# Altium schematic sheet Altium_1_v03_01_GLUE_LOGIC_4Plane_P1.schdoc
size 309 x 223 mm; Symbol: Sheet-Symbol_A4; Device: Sheet-Symbol_A4; @Project Name: The20c_v03; @Page Count: 3; @Update Date: 2026-09-12; @Create Date: 2024-08-20; @Schematic Name: v03_01_GLUE_LOGIC_4Plane; @Page No: 1; @Page Name: v03_01_GLUE_LOGIC_4Plane_P1; Company: OsoLabs.tech; Reviewed: OsoLabs; Version: v03_01; Page Size: A4; Part Number: v03_01_GLUE_LOGIC; Drawn: OsoLabs; @Board Name: v03_01_GLUE_LOGIC_4Plane; @Create Time: 17:17:24; @Update Time: 11:45:47
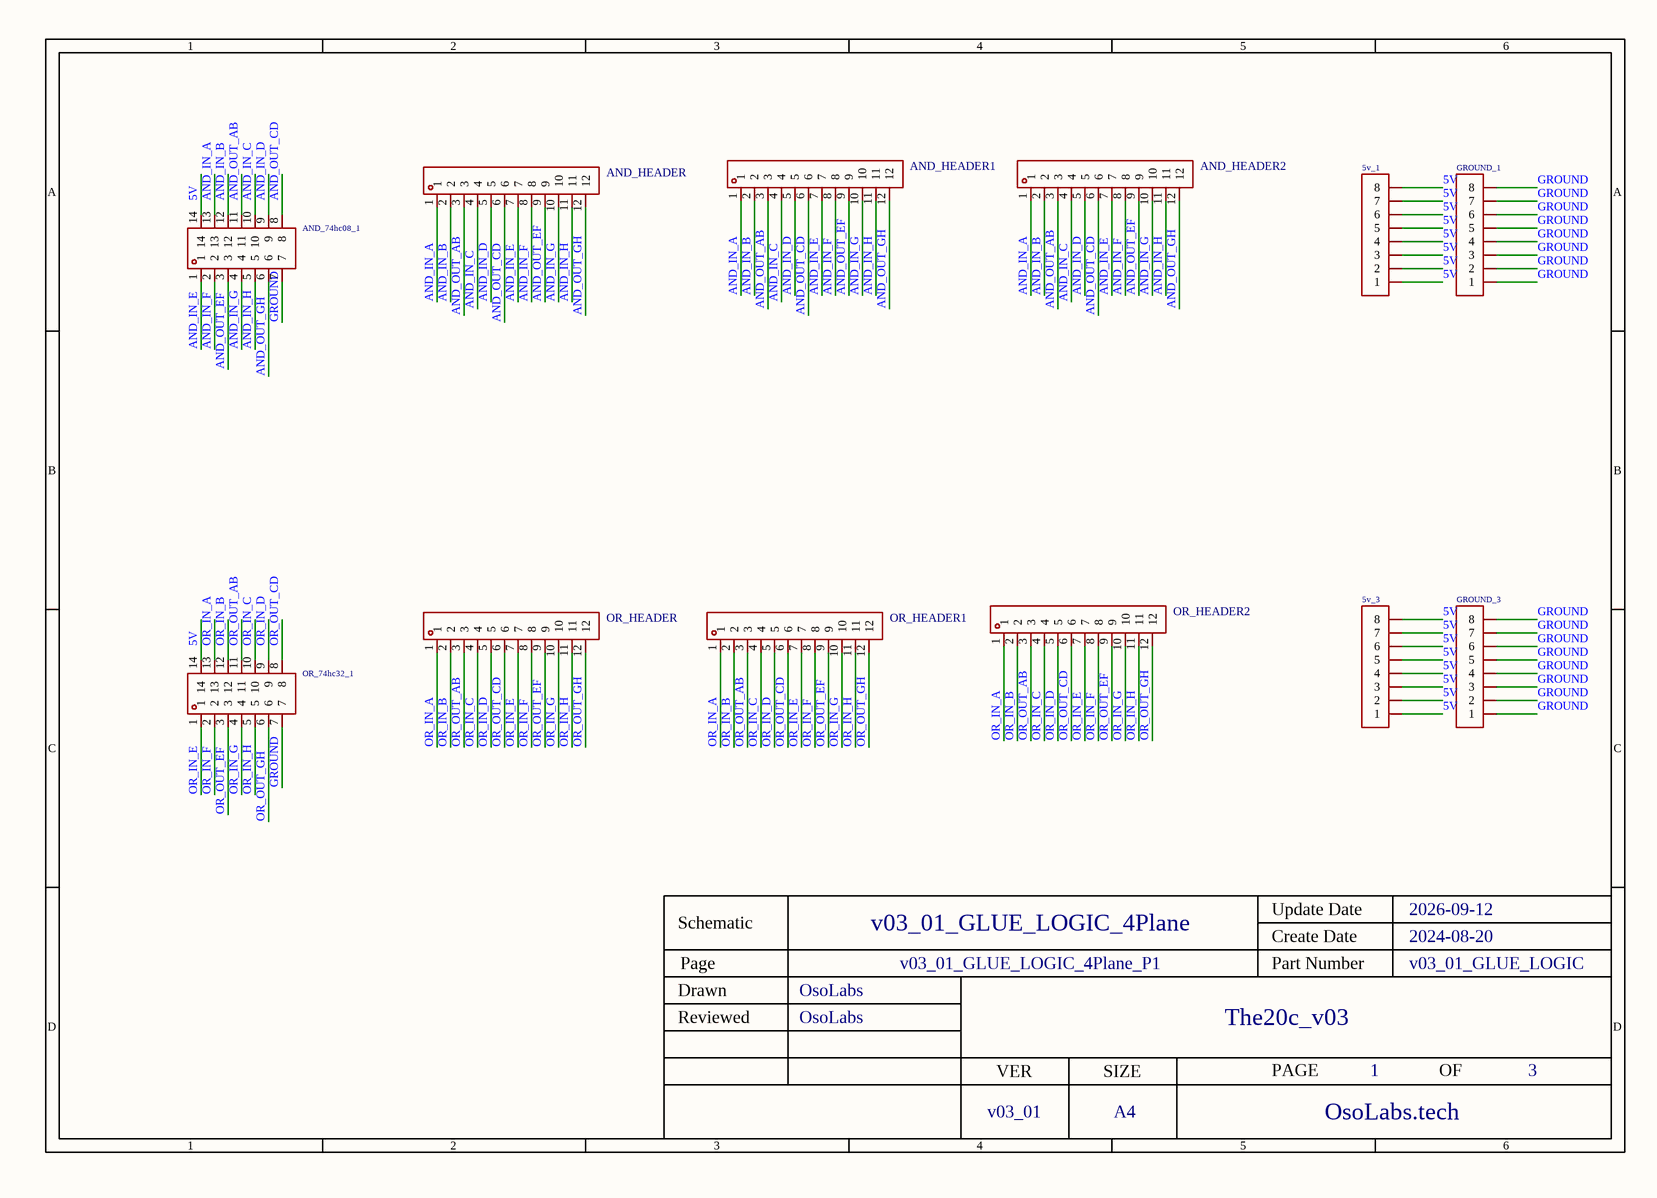
[diagram p0: Altium_1_v03_01_GLUE_LOGIC_4Plane_P1.schdoc]

## Parts
5v_1  2.54-1*8P母环保  [HDR-TH_8P-P2.54-V-F-1]  (value not drawn)
5v_3  2.54-1*8P母环保  [HDR-TH_8P-P2.54-V-F-1]  (value not drawn)
AND_74hc08_1  IC-14P窄  [DIP-14_L17.8-W10.2-P2.54-BL]  (value not drawn)
AND_HEADER  PM254-1-12-Z-8.5  [HDR-TH_12P-P2.54-V-F]  (value not drawn)
AND_HEADER1  PM254-1-12-Z-8.5  [HDR-TH_12P-P2.54-V-F]  (value not drawn)
AND_HEADER2  PM254-1-12-Z-8.5  [HDR-TH_12P-P2.54-V-F]  (value not drawn)
GROUND_1  2.54-1*8P母环保  [HDR-TH_8P-P2.54-V-F-1]  (value not drawn)
GROUND_3  2.54-1*8P母环保  [HDR-TH_8P-P2.54-V-F-1]  (value not drawn)
OR_74hc32_1  IC-14P窄  [DIP-14_L17.8-W10.2-P2.54-BL]  (value not drawn)
OR_HEADER  PM254-1-12-Z-8.5  [HDR-TH_12P-P2.54-V-F]  (value not drawn)
OR_HEADER1  PM254-1-12-Z-8.5  [HDR-TH_12P-P2.54-V-F]  (value not drawn)
OR_HEADER2  PM254-1-12-Z-8.5  [HDR-TH_12P-P2.54-V-F]  (value not drawn)

## Nets
5V: 5v_1.1 5v_1.2 5v_1.3 5v_1.4 5v_1.5 5v_1.6 5v_1.7 5v_1.8 5v_3.1 5v_3.2 5v_3.3 5v_3.4 5v_3.5 5v_3.6 5v_3.7 5v_3.8 AND_74hc08_1.14 OR_74hc32_1.14
AND_IN_A: AND_74hc08_1.13 AND_HEADER.1 AND_HEADER1.1 AND_HEADER2.1
AND_IN_B: AND_74hc08_1.12 AND_HEADER.2 AND_HEADER1.2 AND_HEADER2.2
AND_IN_C: AND_74hc08_1.10 AND_HEADER.4 AND_HEADER1.4 AND_HEADER2.4
AND_IN_D: AND_74hc08_1.9 AND_HEADER.5 AND_HEADER1.5 AND_HEADER2.5
AND_IN_E: AND_74hc08_1.1 AND_HEADER.7 AND_HEADER1.7 AND_HEADER2.7
AND_IN_F: AND_74hc08_1.2 AND_HEADER.8 AND_HEADER1.8 AND_HEADER2.8
AND_IN_G: AND_74hc08_1.4 AND_HEADER.10 AND_HEADER1.10 AND_HEADER2.10
AND_IN_H: AND_74hc08_1.5 AND_HEADER.11 AND_HEADER1.11 AND_HEADER2.11
AND_OUT_AB: AND_74hc08_1.11 AND_HEADER.3 AND_HEADER1.3 AND_HEADER2.3
AND_OUT_CD: AND_74hc08_1.8 AND_HEADER.6 AND_HEADER1.6 AND_HEADER2.6
AND_OUT_EF: AND_74hc08_1.3 AND_HEADER.9 AND_HEADER1.9 AND_HEADER2.9
AND_OUT_GH: AND_74hc08_1.6 AND_HEADER.12 AND_HEADER1.12 AND_HEADER2.12
GROUND: AND_74hc08_1.7 GROUND_1.1 GROUND_1.2 GROUND_1.3 GROUND_1.4 GROUND_1.5 GROUND_1.6 GROUND_1.7 GROUND_1.8 GROUND_3.1 GROUND_3.2 GROUND_3.3 GROUND_3.4 GROUND_3.5 GROUND_3.6 GROUND_3.7 GROUND_3.8 OR_74hc32_1.7
OR_IN_A: OR_74hc32_1.13 OR_HEADER.1 OR_HEADER1.1 OR_HEADER2.1
OR_IN_B: OR_74hc32_1.12 OR_HEADER.2 OR_HEADER1.2 OR_HEADER2.2
OR_IN_C: OR_74hc32_1.10 OR_HEADER.4 OR_HEADER1.4 OR_HEADER2.4
OR_IN_D: OR_74hc32_1.9 OR_HEADER.5 OR_HEADER1.5 OR_HEADER2.5
OR_IN_E: OR_74hc32_1.1 OR_HEADER.7 OR_HEADER1.7 OR_HEADER2.7
OR_IN_F: OR_74hc32_1.2 OR_HEADER.8 OR_HEADER1.8 OR_HEADER2.8
OR_IN_G: OR_74hc32_1.4 OR_HEADER.10 OR_HEADER1.10 OR_HEADER2.10
OR_IN_H: OR_74hc32_1.5 OR_HEADER.11 OR_HEADER1.11 OR_HEADER2.11
OR_OUT_AB: OR_74hc32_1.11 OR_HEADER.3 OR_HEADER1.3 OR_HEADER2.3
OR_OUT_CD: OR_74hc32_1.8 OR_HEADER.6 OR_HEADER1.6 OR_HEADER2.6
OR_OUT_EF: OR_74hc32_1.3 OR_HEADER.9 OR_HEADER1.9 OR_HEADER2.9
OR_OUT_GH: OR_74hc32_1.6 OR_HEADER.12 OR_HEADER1.12 OR_HEADER2.12

## Notes on the sheet
- 1
- 2
- 3
- 4
- 5
- 6
- A
- B
- C
- Schematic
- v03_01_GLUE_LOGIC_4Plane
- Create Date
- Update Date
- 2026-09-12
- 2024-08-20
- Reviewed
- Drawn
- Page
- OsoLabs
- v03_01_GLUE_LOGIC_4Plane_P1
- Part Number
- The20c_v03
- v03_01_GLUE_LOGIC
- D
- VER
- SIZE
- PAGE
- OF
- v03_01
- A4
- OsoLabs.tech

## Library data of the parts
5v_1 5v_3 GROUND_1 GROUND_3 = 2.54-1*8P母环保: Manufacturer: BOOMELE(博穆精密); Symbol: Header-Female-2.54_1x8; Add into BOM: yes; Holes Structure: 1x8P; Pitch: 2.54mm; Number of Holes: 8P; Device: 2.54-1*8P母环保; Supplier: LCSC; Manufacturer Part: 2.54-1*8P母环保; Supplier Part: C27438; JLCPCB Part Class: Extended Part; LCSC Part Name: 间距:2.54mm 1x8P 直插; Supplier Footprint: 插件,P=2.54mm; Datasheet: https://atta.szlcsc.com/upload/public/pdf/source/20231221/1CA800C6799ED97958773716FAA1BFFE.pdf; Convert to PCB: yes; Row Spacing: -; Mounting Type: Straight; Number of Rows: Plugin; Insulation Height: -; Contact Material: -; Contact Plating: -
AND_74hc08_1 OR_74hc32_1 = IC-14P窄: Manufacturer: BOOMELE(博穆精密); Symbol: IC seat 14P; Add into BOM: yes; IC Type: DIP; Pitch: 2.54mm; Row Spacing: 7.62mm; Number of Positions: 14P; Device: IC-14P窄; Supplier: LCSC; Supplier Part: C2325; Manufacturer Part: IC-14P窄; JLCPCB Part Class: Extended Part; LCSC Part Name: 间距2.54mm P数:14P; Supplier Footprint: DIP-14; Datasheet: https://atta.szlcsc.com/upload/public/pdf/source/20151118/1457707579760.pdf; Convert to PCB: yes; Contact Plating: -
AND_HEADER AND_HEADER1 AND_HEADER2 OR_HEADER OR_HEADER1 OR_HEADER2 = PM254-1-12-Z-8.5: Manufacturer: HCTL(华灿天禄); Add into BOM: yes; Holes Structure: 1x12P; Pitch: 2.54mm; Circular Hole / Square Hole: Square Holes; Number of Holes: 12P; Current Rating (Max): 3A; Holes Direction: Top; Soldering Temperature(Max): 260℃@5S; Symbol: PM254-1-12-Z-8.5; Device: PM254-1-12-Z-8.5; LCSC Part Name: 1x12P 间距:2.54mm 直插; Supplier Part: C2897375; Manufacturer Part: PM254-1-12-Z-8.5; Supplier Footprint: 插件,P=2.54mm; JLCPCB Part Class: Extended Part; Datasheet: https://atta.szlcsc.com/upload/public/pdf/source/20230609/534BE42964C679BDE98E061007C4ABD6.pdf; Supplier: LCSC; Convert to PCB: yes; Row Spacing: -; Mounting Type: Straight; Number of Rows: Plugin; Voltage Rating (Max): -; Insulation Height: 8.5mm; Contact Material: Copper Alloy; Operating Temperature Range: -40℃~+105℃